# Altium schematic sheet Control Buttons.SchDoc
size A4; SheetNumber: 6; SheetTotal: 13
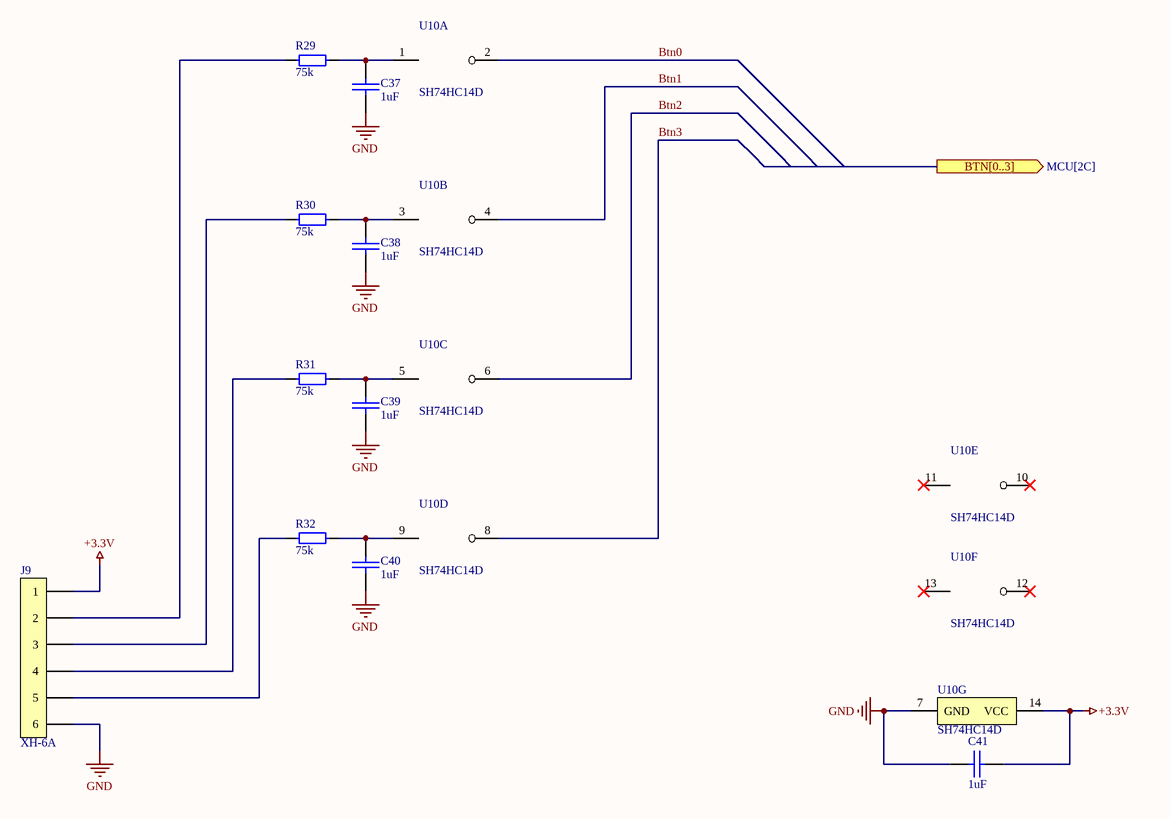
[diagram p0: Control Buttons.SchDoc]

## Parts
C37  1uF  [0805 Capicator]
C38  1uF  [0805 Capicator]
C39  1uF  [0805 Capicator]
C40  1uF  [0805 Capicator]
C41  1uF  [0805 Capicator]
J9  XH-6A  [CONN 1X6 (XH 2.54)]
R29  75k  [0805 Resistor]
R30  75k  [0805 Resistor]
R31  75k  [0805 Resistor]
R32  75k  [0805 Resistor]
U10  SH74HC14D  [SOIC-14]  (parts A,B,C,D,E,F,G of 7)

## Ports
BTN[0..3] (out, see MCU[2C])

## Nets
+3.3V: C41.1 J9.1 U10.14(VCC)
GND: C37.1 C38.1 C39.1 C40.1 C41.2 J9.6 U10.7(GND)
Btn0: U10.2(1Y)
Btn1: U10.4(2Y)
Btn2: U10.6(3Y)
Btn3: U10.8(4Y)
NetC37_2: C37.2 R29.2 U10.1(1A)
NetC38_2: C38.2 R30.2 U10.3(2A)
NetC39_2: C39.2 R31.2 U10.5(3A)
NetC40_2: C40.2 R32.2 U10.9(4A)
NetJ9_2: J9.2 R29.1
NetJ9_3: J9.3 R30.1
NetJ9_4: J9.4 R31.1
NetJ9_5: J9.5 R32.1

Not connected (* = marked no-connect by the designer): U10 10(5Y)* 11(5A)* 12(6Y)* 13(6A)*

## Library data of the parts
C37-C41 = Cap 1uF (0805): 1uF X7R 10% 16V 0805; Manufacturer: Murata Manufacturing; Part Number: GRM21BR71C105KA01K; Type: Capacitor; ComponentLink1Description: Chip&Dip; ComponentLink1URL: https://www.chipdip.ru/product/grm21br71c105k
J9 = Connector XH-6A 2.54: Connector on the board straight 6pin 2.54mm; Type: Connector; ComponentLink1Description: Buy; ComponentLink1URL: https://radioremont.com/product/razem-xh-6a-2-54mm-k244-2/
R29-R32 = Res 75k (0805): 0.125W 0805 75k, 1%; Part Number: RC0805FR-0775KL; Manufacturer: Taiwan; Type: Resistor; ComponentLink1Description: Chip&Dip; ComponentLink1URL: https://www.chipdip.ru/product0/9000079535
U10 = Schmitt Trigger SN74HC14D: SNx4HC14 Hex Schmitt-Trigger Inverters SOIC-14; Type: IC; ComponentLink1Description: Buy; ComponentLink1URL: https://radioremont.com/product/mikroskhema-sn74hc14d-k17-22/#/discount-tab/; ComponentLink2Description: Datasheet; ComponentLink2URL: https://static.chipdip.ru/lib/908/DOC012908201.pdf